# Altium schematic sheet Main.SchDoc
size A; SheetNumber: 1; SheetTotal: 4
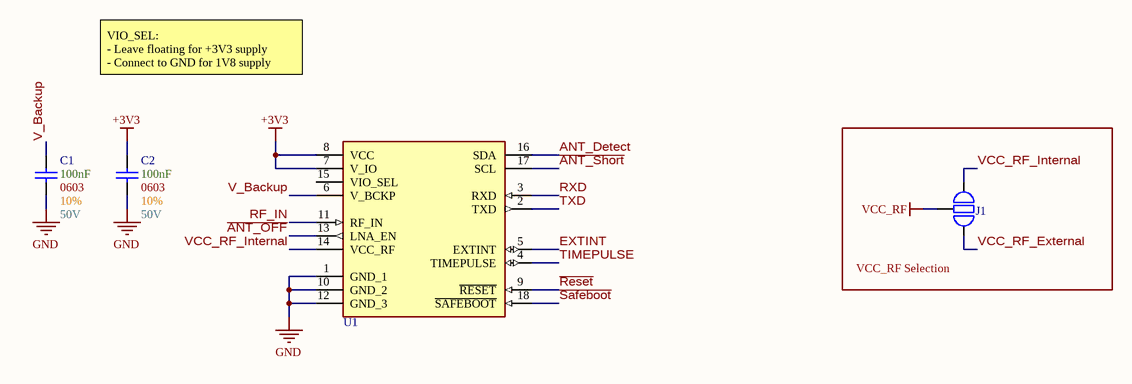
[diagram p0: Main.SchDoc]

## Parts
C1  Max Voltage: 50V  Size Package: 0603  Tolerance: 10%  Capacitance: 100nF  [[Cap] SMD 0603]  (hidden comment: [Cap] 0603 0.1uF 10% 50V)
C2  Max Voltage: 50V  Size Package: 0603  Tolerance: 10%  Capacitance: 100nF  [[Cap] SMD 0603]  (hidden comment: [Cap] 0603 0.1uF 10% 50V)
J1  [Jumper] Thru-Hole 3pin  [[Jumper] Thru-Hole 3pin]  (value not drawn)  (no BOM)
U1  Dual-Band GNSS Module  [[GNSS] MAX-F10S-00B]  (value not drawn)

## Blocks framed on the sheet
VCC_RF Selection: J1

## Nets
+3V3: C2.2 U1.7(V_IO) U1.8(VCC)
GND: C1.1 C2.1 U1.1(GND_1) U1.10(GND_2) U1.12(GND_3)
VCC_RF: J1.2(Common)
~{ANT_OFF}: U1.13(LNA_EN)
~{ANT_Short}: U1.17(SCL)
~{Reset}: U1.9(~{RESET})
~{Safeboot}: U1.18(~{SAFEBOOT})
ANT_Detect: U1.16(SDA)
EXTINT: U1.5(EXTINT)
RF_IN: U1.11(RF_IN)
RXD: U1.3(RXD)
TIMEPULSE: U1.4(TIMEPULSE)
TXD: U1.2(TXD)
V_Backup: C1.2 U1.6(V_BCKP)
VCC_RF_External: J1.3
VCC_RF_Internal: J1.1 U1.14(VCC_RF)

Not connected (* = marked no-connect by the designer): U1 15(VIO_SEL)

## Notes on the sheet
- VIO_SEL:
  - Leave floating for +3V3 supply
  - Connect to GND for 1V8 supply

## Library data of the parts
C1 C2 = [Cap] 0603 0.1uF 10% 50V: CL10B104KB8NNNC; Supplier 1: DigiKey; Supplier Part Number 1: 1276-1000-6-ND
U1 = [GNSS] MAX-F10S-00B: MAX-F10S-00B